# Altium project STM32F103CBT6.PrjPcb
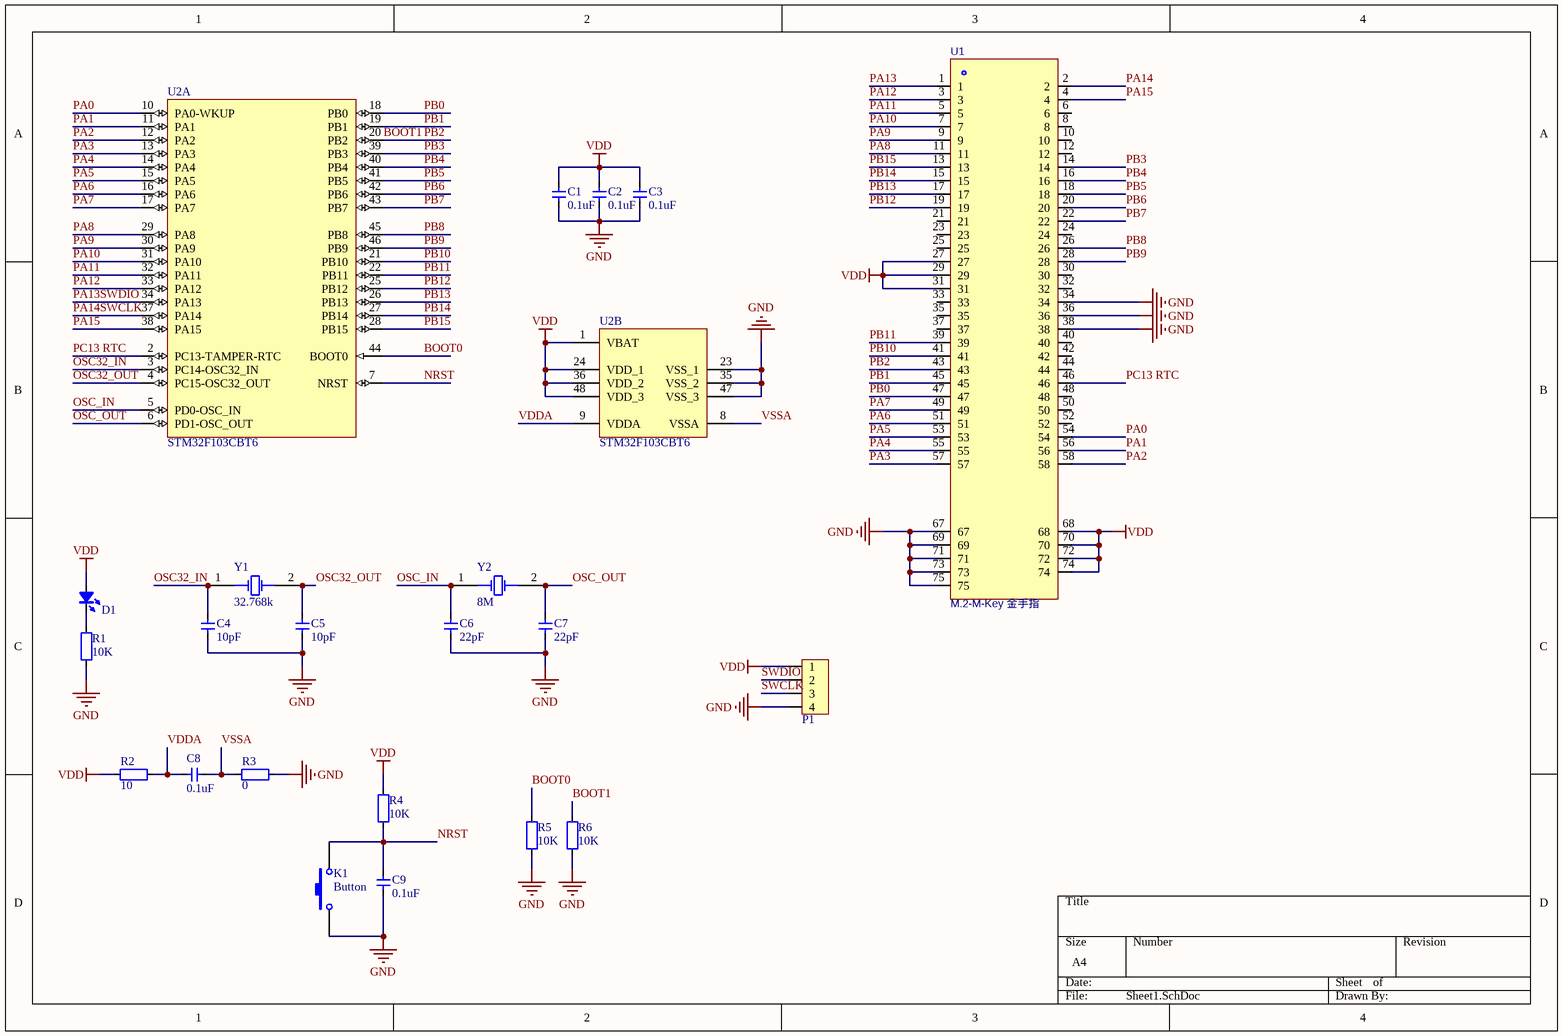
[diagram p0: Sheet1.SchDoc]
1 sheet, 22 parts. Net scope: global (net labels, ports and power ports of the same name join across sheets).
Board file: PCB1.PcbDoc

## Sheet Sheet1.SchDoc
size A4; SheetNumber: 1; SheetTotal: 1

### Parts
C1  0.1uF  [C0603]
C2  0.1uF  [C0603]
C3  0.1uF  [C0603]
C4  10pF  [C0603]
C5  10pF  [C0603]
C6  22pF  [C0603]
C7  22pF  [C0603]
C8  0.1uF  [C0603]
C9  0.1uF  [C0603]
D1  color?  [LED0603]  (value not drawn)
K1  Button  [BUTTON-K2]
P1  HDR1x4_2.0  [HDR 4_2]  (value not drawn)
R1  10K  [R0603]
R2  10  [R0603]
R3  0  [R0603]
R4  10K  [R0603]
R5  10K  [R0603]
R6  10K  [R0603]
U1  M.2-M-Key 金手指  [M.2_NGFF]
U2  STM32F103CBT6  [STM-LQFP48_N]  (parts A,B of 2)
Y1  XTAL 32.768KHz 2P  [3215 2Pin]  (value not drawn)
Y2  8M  [5032 2Pin]

### Nets
GND: C1.1 C2.1 C3.1 C4.1 C5.1 C6.1 C7.1 C9.1 K1.1 P1.4 R1.1 R3.2 R5.1 R6.1 U1.34 U1.36 U1.38 U1.67 U1.69 U1.71 U1.73 U1.75 U2.23(VSS_1) U2.35(VSS_2) U2.47(VSS_3)
VDD: C1.2 C2.2 C3.2 D1.1(A) P1.1 R2.1 R4.2 U1.27 U1.29 U1.31 U1.68 U1.70 U1.72 U1.74 U2.1(VBAT) U2.24(VDD_1) U2.36(VDD_2) U2.48(VDD_3)
BOOT0: R5.2 U2.44(BOOT0)
BOOT1: R6.2 U1.43 U2.20(PB2)  [also labelled PB2]
NRST: C9.2 K1.2 R4.1 U2.7(NRST)
OSC32_IN: C4.2 U2.3(PC14-OSC32_IN) Y1.1(OSC1)
OSC32_OUT: C5.2 U2.4(PC15-OSC32_OUT) Y1.2(OSC2)
OSC_IN: C6.2 U2.5(PD0-OSC_IN) Y2.1(OSC1)
OSC_OUT: C7.2 U2.6(PD1-OSC_OUT) Y2.2(OSC2)
PA0: U1.54 U2.10(PA0-WKUP)
PA1: U1.56 U2.11(PA1)
PA2: U1.58 U2.12(PA2)
PA3: U1.57 U2.13(PA3)
PA4: U1.55 U2.14(PA4)
PA5: U1.53 U2.15(PA5)
PA6: U1.51 U2.16(PA6)
PA7: U1.49 U2.17(PA7)
PA8: U1.11 U2.29(PA8)
PA9: U1.9 U2.30(PA9)
PA10: U1.7 U2.31(PA10)
PA11: U1.5 U2.32(PA11)
PA12: U1.3 U2.33(PA12)
PA13: P1.2 U1.1 U2.34(PA13)  [also labelled SWDIO]
PA14: P1.3 U1.2 U2.37(PA14)  [also labelled SWCLK]
PA15: U1.4 U2.38(PA15)
PB0: U1.47 U2.18(PB0)
PB1: U1.45 U2.19(PB1)
PB3: U1.14 U2.39(PB3)
PB4: U1.16 U2.40(PB4)
PB5: U1.18 U2.41(PB5)
PB6: U1.20 U2.42(PB6)
PB7: U1.22 U2.43(PB7)
PB8: U1.26 U2.45(PB8)
PB9: U1.28 U2.46(PB9)
PB10: U1.41 U2.21(PB10)
PB11: U1.39 U2.22(PB11)
PB12: U1.19 U2.25(PB12)
PB13: U1.17 U2.26(PB13)
PB14: U1.15 U2.27(PB14)
PB15: U1.13 U2.28(PB15)
PC13 RTC: U1.46 U2.2(PC13-TAMPER-RTC)
VDDA: C8.1 R2.2 U2.9(VDDA)
VSSA: C8.2 R3.1 U2.8(VSSA)
NetD1_2: D1.2(K) R1.2

Not connected (* = marked no-connect by the designer): U1 6 8 10 12 21 23 24 25 30 32 33 35 37 40 42 44 48 50 52

### Notes on the sheet
- (in symbol XTAL 32.768KHz 2P) 32.768k

### Library data of the parts
C1-C9 = 贴片C: Capacitor; Value: 104; Published: 8-Jun-2000; LatestRevisionDate: 17-Jul-2002; LatestRevisionNote: Re-released for DXP Platform.; PackageReference: RAD-0.3; Publisher: Altium Limited
D1 = 贴片LED: LED; Type: 0402; Value: color?
R1-R6 = 贴片R: Resistor; Value: 1K; Published: 8-Jun-2000; Revision: July-2002: Re-released for DXP Platform.; Publisher: Altium Limited
U1 = M.2-M-Key 金手指: Contributor: zengjf; spicePre: U; spiceSymbolName: M2-M-Key
U2 = STM32F103CBT6: ARM Cortex-M3 32-bit MCU, 128 KB Flash, 20 KB Internal RAM, 37 I/Os, 48-pin LQFP, -40 to 85 degC, Tray; Supply Voltage(Vcc) min (V): 2; Operating Frequency(F) (Processor speed) (MHz): 72; A/D Converter: 2x12-bit (10 Channel); FLASH Size (Prog) (kB): 128; Internal RAM Size (kB): 20; I/Os (High Current): 37; ComponentLink2Description: Datasheet; PackageReference: LQFP48; PartNumber: STM32F103CBT6; ComponentLink1Description: Manufacturer URL; DatasheetVersion: Rev. 16; PackageVersion: Rev. 6, 06/2013; Packing: Tray; ComponentLink1URL: http://www.st.com/web/en/home.html; Mounting Technology: Surface Mount; ComponentLink3URL: http://www.st.com/st-web-ui/static/active/en/resource/technical/document/datasheet/DM00058181.pdf; PackageDescription: 48-Pin Low Profile Quad Flat Package, 7 x 7 mm Body, 0.5 mm Pitch; Core: ARM Cortex-M3; ComponentLink3Description: Package Specification; ComponentLink2URL: http://www.st.com/st-web-ui/static/active/en/resource/technical/document/datasheet/CD00161566.pdf
Y2 = XTAL 8Mhz 2pin
K1 = Button: Published: 24-Mar-1999; LatestRevisionDate: 17-Jul-2002; LatestRevisionNote: Re-released for DXP Platform.; PackageReference: SPST-2; Publisher: Altium Limited